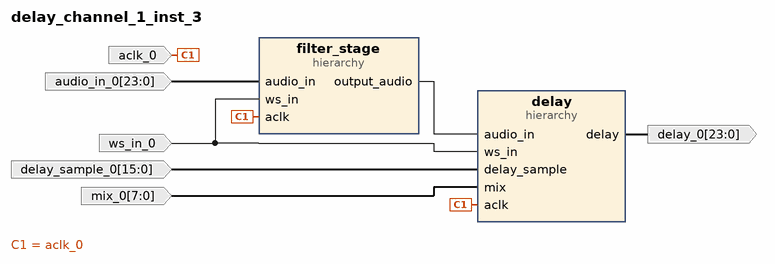
[diagram p0: block diagram of the top level]
# Vivado block design delay_channel_1_inst_3, xc7a100tcsg324-1, Vivado 2022.1
create_bd_design delay_channel_1_inst_3

create_bd_port -dir O -from 23 -to 0 delay_0
create_bd_port -dir I -from 7 -to 0 mix_0
create_bd_port -dir I -from 15 -to 0 delay_sample_0
create_bd_port -dir I ws_in_0
create_bd_port -dir I -from 23 -to 0 audio_in_0
create_bd_port -dir I aclk_0

create_bd_cell -type hier delay
create_bd_cell -type hier filter_stage

# ---- hierarchy /delay ----
current_bd_instance /delay
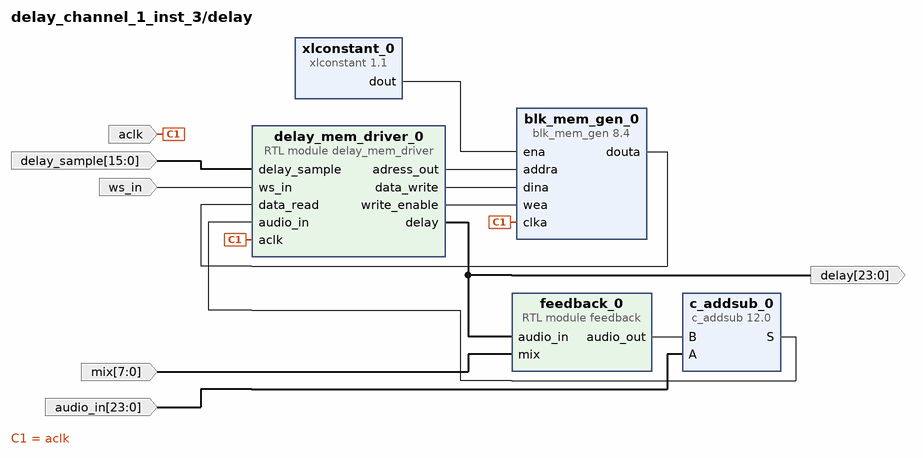
[diagram p1: block diagram inside /delay]
create_bd_pin -dir I aclk
create_bd_pin -dir I -from 23 -to 0 audio_in
create_bd_pin -dir I ws_in
create_bd_pin -dir I -from 15 -to 0 delay_sample
create_bd_pin -dir O -from 23 -to 0 delay
create_bd_pin -dir I -from 7 -to 0 mix

create_bd_cell -type ip -vlnv xilinx.com:ip:blk_mem_gen:8.4 blk_mem_gen_0
set_property -dict [list \
  CONFIG.Enable_32bit_Address false \
  CONFIG.Operating_Mode_A NO_CHANGE \
  CONFIG.Read_Width_A 24 \
  CONFIG.Register_PortA_Output_of_Memory_Primitives true \
  CONFIG.Use_Byte_Write_Enable false \
  CONFIG.Use_RSTA_Pin false \
  CONFIG.Write_Depth_A 65536 \
  CONFIG.Write_Width_A 24 \
  CONFIG.use_bram_block Stand_Alone \
] [get_bd_cells blk_mem_gen_0]
create_bd_cell -type ip -vlnv xilinx.com:ip:xlconstant:1.1 xlconstant_0
create_bd_cell -type module -reference feedback feedback_0
create_bd_cell -type ip -vlnv xilinx.com:ip:c_addsub:12.0 c_addsub_0
set_property -dict [list \
  CONFIG.A_Type Signed \
  CONFIG.A_Width 24 \
  CONFIG.B_Type Signed \
  CONFIG.B_Value 000000000000000000000000 \
  CONFIG.B_Width 24 \
  CONFIG.CE false \
  CONFIG.Latency 0 \
  CONFIG.Out_Width 24 \
] [get_bd_cells c_addsub_0]
create_bd_cell -type module -reference delay_mem_driver delay_mem_driver_0

# ---- hierarchy /filter_stage ----
current_bd_instance /filter_stage
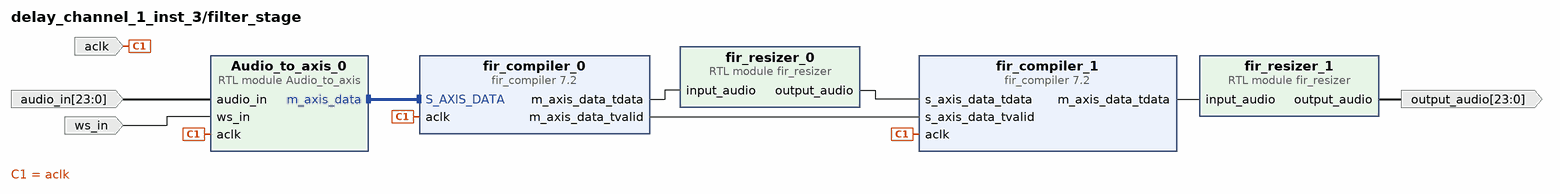
[diagram p2: block diagram inside /filter_stage]
create_bd_pin -dir I -from 23 -to 0 audio_in
create_bd_pin -dir I ws_in
create_bd_pin -dir I aclk
create_bd_pin -dir O -from 23 -to 0 output_audio

create_bd_cell -type module -reference Audio_to_axis Audio_to_axis_0
create_bd_cell -type ip -vlnv xilinx.com:ip:fir_compiler:7.2 fir_compiler_0
set_property -dict [list \
  CONFIG.Clock_Frequency 11.29 \
  CONFIG.CoefficientSource COE_File \
  CONFIG.Coefficient_File ../../../../../../../../Gitaar_effect_delay.srcs/lowpass.coe \
  CONFIG.Coefficient_Fractional_Bits 0 \
  CONFIG.Coefficient_Sets 1 \
  CONFIG.Coefficient_Sign Signed \
  CONFIG.Coefficient_Structure Inferred \
  CONFIG.Coefficient_Width 16 \
  CONFIG.Data_Width 24 \
  CONFIG.Filter_Architecture Systolic_Multiply_Accumulate \
  CONFIG.Output_Rounding_Mode Truncate_LSBs \
  CONFIG.Output_Width 26 \
  CONFIG.Quantization Integer_Coefficients \
  CONFIG.Sample_Frequency 0.044 \
] [get_bd_cells fir_compiler_0]
create_bd_cell -type module -reference fir_resizer fir_resizer_0
create_bd_cell -type ip -vlnv xilinx.com:ip:fir_compiler:7.2 fir_compiler_1
set_property -dict [list \
  CONFIG.Clock_Frequency 11.29 \
  CONFIG.CoefficientSource COE_File \
  CONFIG.Coefficient_File ../../../../../../../../Gitaar_effect_delay.srcs/highpass.coe \
  CONFIG.Coefficient_Fractional_Bits 0 \
  CONFIG.Coefficient_Sets 1 \
  CONFIG.Coefficient_Sign Signed \
  CONFIG.Coefficient_Structure Inferred \
  CONFIG.Coefficient_Width 16 \
  CONFIG.Filter_Architecture Systolic_Multiply_Accumulate \
  CONFIG.Output_Rounding_Mode Truncate_LSBs \
  CONFIG.Output_Width 26 \
  CONFIG.Quantization Integer_Coefficients \
  CONFIG.Sample_Frequency 0.044 \
] [get_bd_cells fir_compiler_1]
create_bd_cell -type module -reference fir_resizer fir_resizer_1

# ---- connections ----

current_bd_instance /delay
connect_bd_net -net Mem_chorus_driver_0_delay [get_bd_pins delay_mem_driver_0/delay] [get_bd_pins delay] [get_bd_pins feedback_0/audio_in]
connect_bd_net [get_bd_pins aclk] [get_bd_pins blk_mem_gen_0/clka] [get_bd_pins delay_mem_driver_0/aclk]
connect_bd_net [get_bd_pins audio_in] [get_bd_pins c_addsub_0/A]
connect_bd_net [get_bd_pins blk_mem_gen_0/douta] [get_bd_pins delay_mem_driver_0/data_read]
connect_bd_net [get_bd_pins c_addsub_0/S] [get_bd_pins delay_mem_driver_0/audio_in]
connect_bd_net [get_bd_pins delay_mem_driver_0/adress_out] [get_bd_pins blk_mem_gen_0/addra]
connect_bd_net [get_bd_pins delay_mem_driver_0/data_write] [get_bd_pins blk_mem_gen_0/dina]
connect_bd_net [get_bd_pins delay_mem_driver_0/write_enable] [get_bd_pins blk_mem_gen_0/wea]
connect_bd_net [get_bd_pins delay_sample] [get_bd_pins delay_mem_driver_0/delay_sample]
connect_bd_net [get_bd_pins feedback_0/audio_out] [get_bd_pins c_addsub_0/B]
connect_bd_net [get_bd_pins mix] [get_bd_pins feedback_0/mix]
connect_bd_net [get_bd_pins ws_in] [get_bd_pins delay_mem_driver_0/ws_in]
connect_bd_net [get_bd_pins xlconstant_0/dout] [get_bd_pins blk_mem_gen_0/ena]

current_bd_instance /filter_stage
connect_bd_intf_net [get_bd_intf_pins Audio_to_axis_0/m_axis_data] [get_bd_intf_pins fir_compiler_0/S_AXIS_DATA]
connect_bd_net [get_bd_pins aclk] [get_bd_pins Audio_to_axis_0/aclk] [get_bd_pins fir_compiler_1/aclk] [get_bd_pins fir_compiler_0/aclk]
connect_bd_net [get_bd_pins audio_in] [get_bd_pins Audio_to_axis_0/audio_in]
connect_bd_net [get_bd_pins fir_compiler_0/m_axis_data_tdata] [get_bd_pins fir_resizer_0/input_audio]
connect_bd_net [get_bd_pins fir_compiler_0/m_axis_data_tvalid] [get_bd_pins fir_compiler_1/s_axis_data_tvalid]
connect_bd_net [get_bd_pins fir_compiler_1/m_axis_data_tdata] [get_bd_pins fir_resizer_1/input_audio]
connect_bd_net [get_bd_pins fir_resizer_0/output_audio] [get_bd_pins fir_compiler_1/s_axis_data_tdata]
connect_bd_net [get_bd_pins fir_resizer_1/output_audio] [get_bd_pins output_audio]
connect_bd_net [get_bd_pins ws_in] [get_bd_pins Audio_to_axis_0/ws_in]

current_bd_instance /
connect_bd_net -net aclk_0_1 [get_bd_ports aclk_0] [get_bd_pins filter_stage/aclk] [get_bd_pins delay/aclk]
connect_bd_net -net audio_in_0_1 [get_bd_ports audio_in_0] [get_bd_pins filter_stage/audio_in]
connect_bd_net [get_bd_pins delay/delay] [get_bd_ports delay_0]
connect_bd_net -net delay_sample_0_1 [get_bd_ports delay_sample_0] [get_bd_pins delay/delay_sample]
connect_bd_net [get_bd_pins filter_stage/output_audio] [get_bd_pins delay/audio_in]
connect_bd_net -net mix_0_1 [get_bd_ports mix_0] [get_bd_pins delay/mix]
connect_bd_net -net ws_in_0_1 [get_bd_ports ws_in_0] [get_bd_pins filter_stage/ws_in] [get_bd_pins delay/ws_in]

validate_bd_design
save_bd_design
